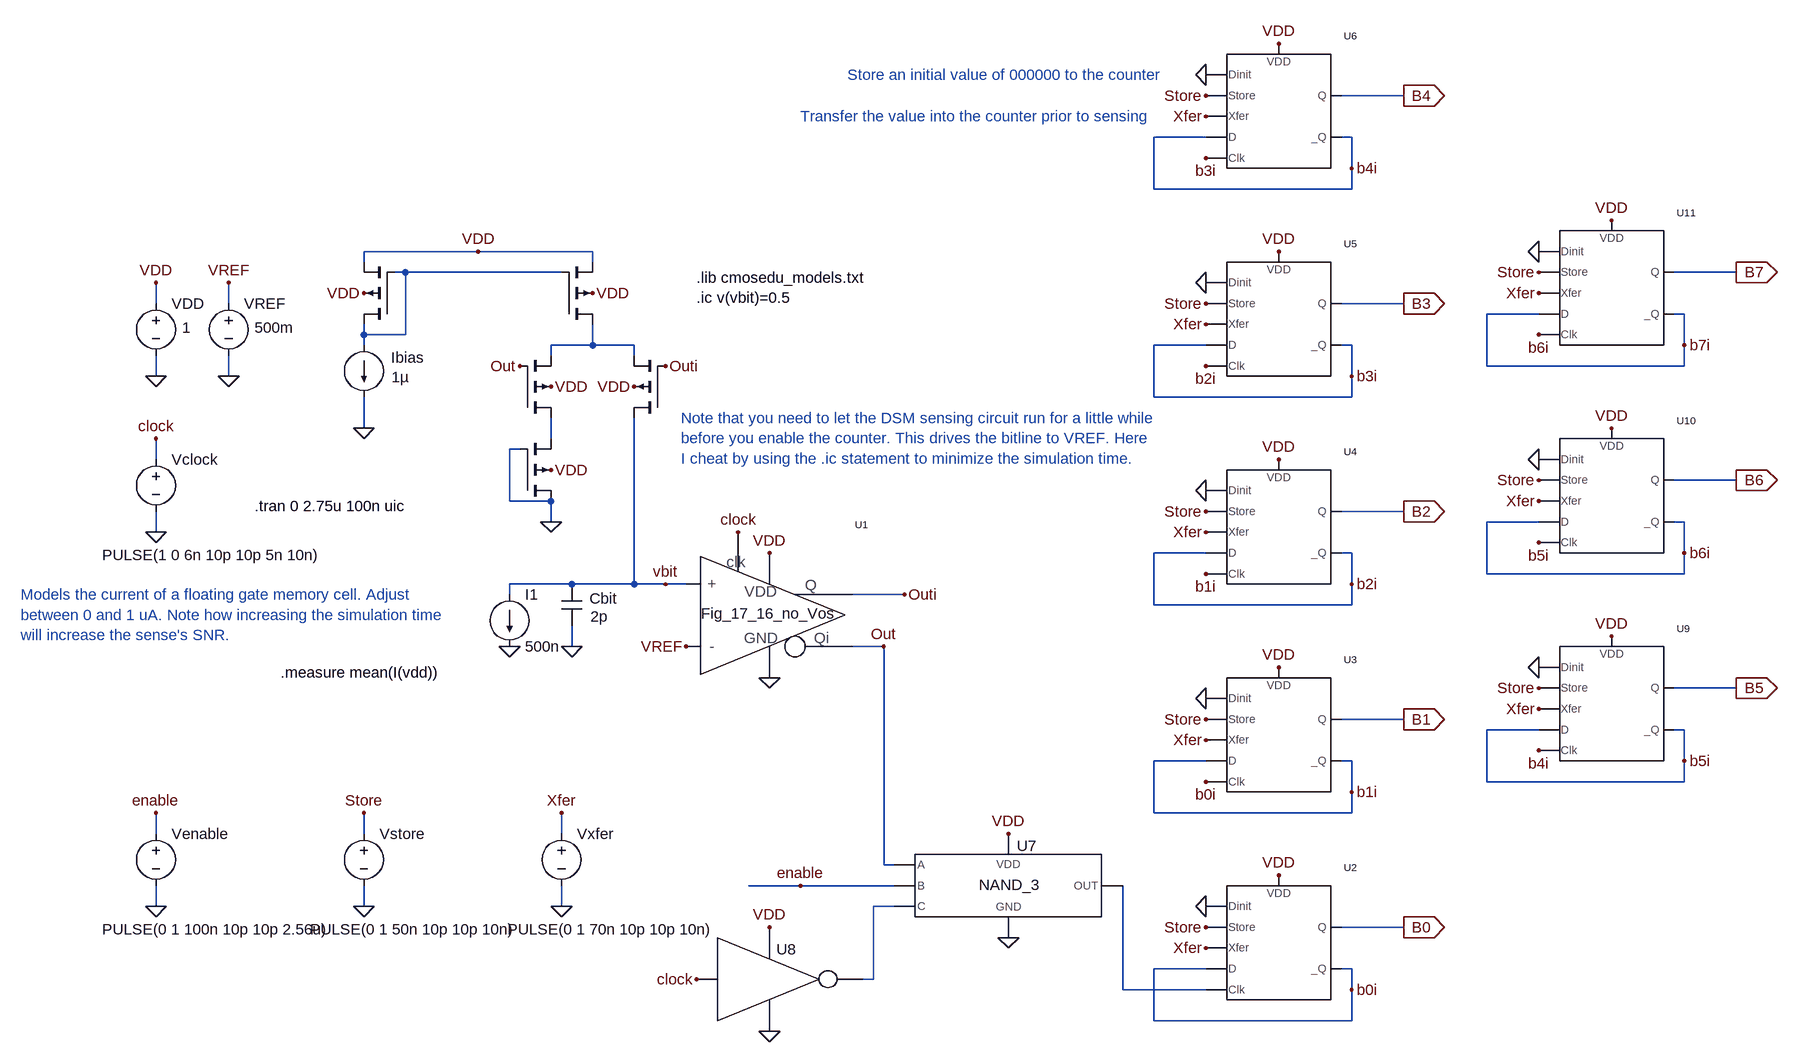
[diagram p0: schematic DSM_sensing_Flash_wcount_8bit.asc]
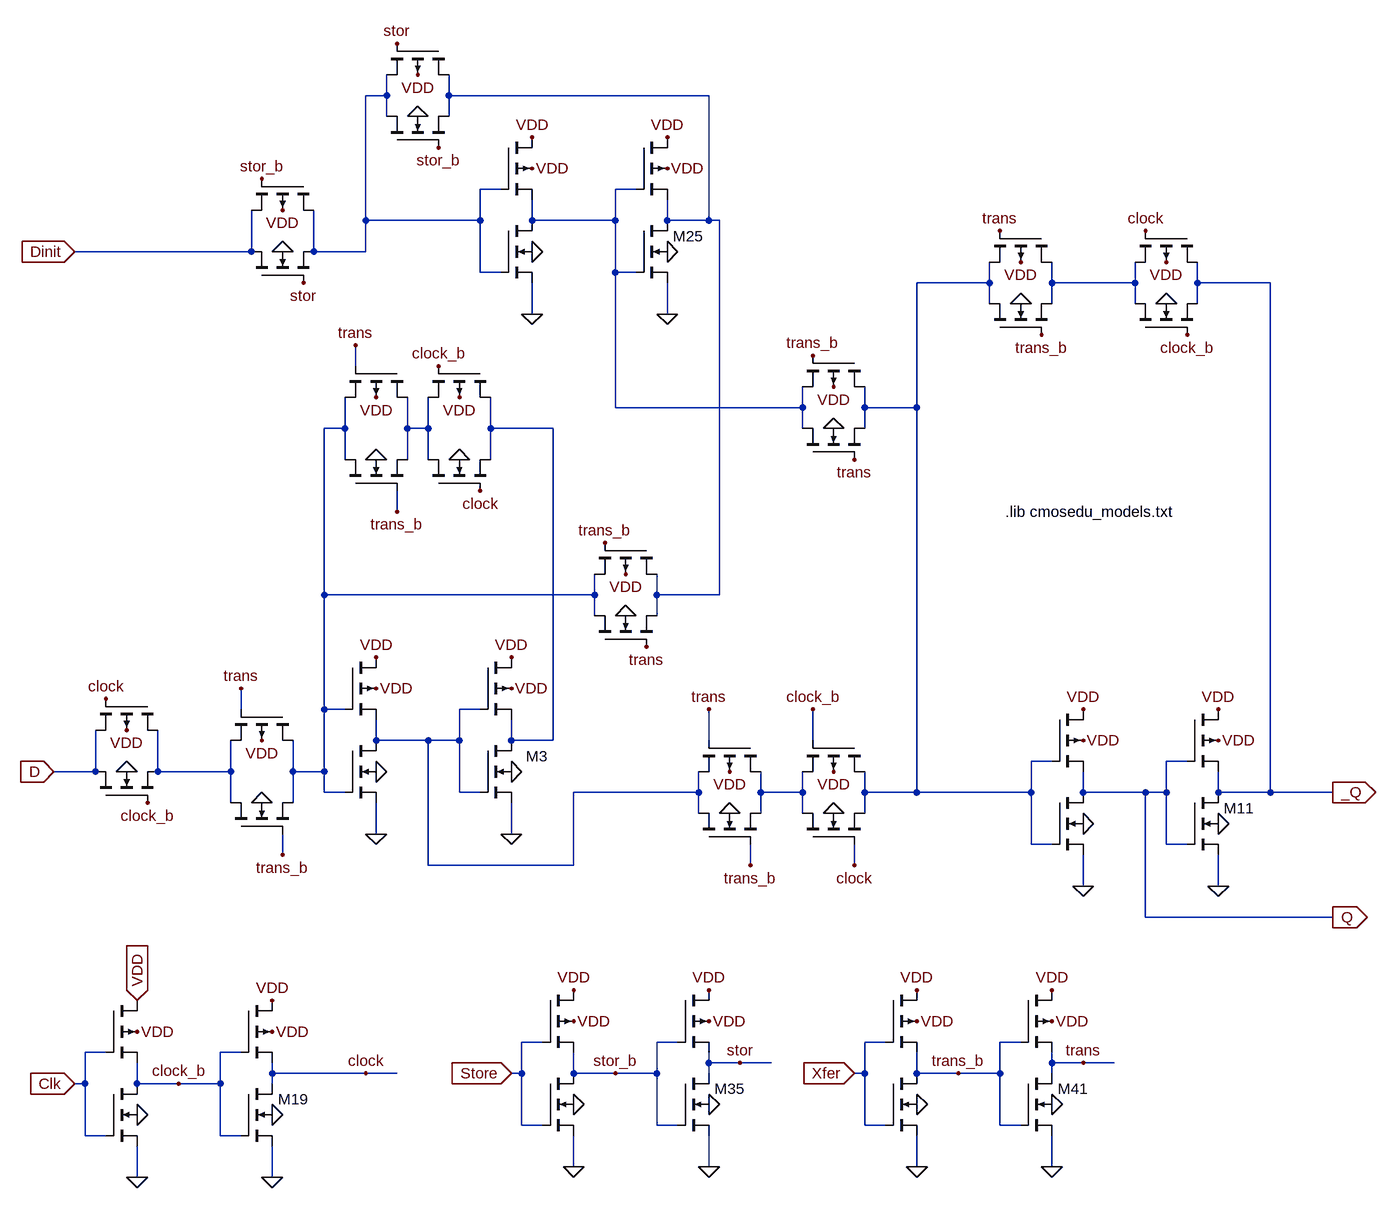
[diagram p1: sub-circuit dsm_counter_bit.asc]
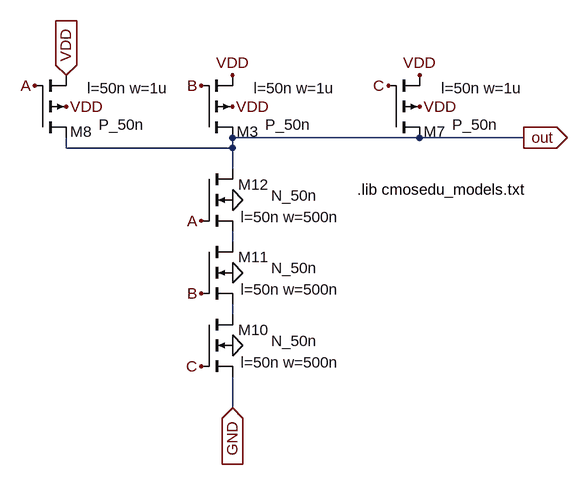
[diagram p2: sub-circuit nand_3.asc]
DSM_sensing_Flash_wcount_8bit.asc, the LTspice schematic file:
Version 4
SHEET 1 2972 1076
WIRE 448 -592 448 -624
WIRE 448 -480 448 -512
WIRE 448 -352 448 -384
WIRE 448 -240 448 -272
WIRE 448 224 448 192
WIRE 448 336 448 304
WIRE 560 -592 560 -624
WIRE 560 -480 560 -512
WIRE 768 -656 768 -672
WIRE 768 -544 768 -560
WIRE 768 -528 768 -544
WIRE 768 -400 768 -448
WIRE 768 224 768 192
WIRE 768 336 768 304
WIRE 832 -640 816 -640
WIRE 832 -544 768 -544
WIRE 832 -544 832 -640
WIRE 944 -672 768 -672
WIRE 992 -288 992 -368
WIRE 992 -144 992 -160
WIRE 1008 -368 992 -368
WIRE 1056 -512 1056 -528
WIRE 1056 -384 1056 -416
WIRE 1056 -288 992 -288
WIRE 1056 -256 1056 -288
WIRE 1072 -640 832 -640
WIRE 1072 224 1072 192
WIRE 1072 336 1072 304
WIRE 1088 -160 992 -160
WIRE 1088 -64 1088 -96
WIRE 1120 -672 944 -672
WIRE 1120 -656 1120 -672
WIRE 1120 -528 1056 -528
WIRE 1120 -528 1120 -560
WIRE 1184 -528 1120 -528
WIRE 1184 -512 1184 -528
WIRE 1184 -160 1088 -160
WIRE 1184 -160 1184 -416
WIRE 1232 -160 1184 -160
WIRE 1264 -160 1232 -160
WIRE 1440 304 1360 304
WIRE 1552 448 1536 448
WIRE 1552 448 1552 336
WIRE 1568 -64 1520 -64
WIRE 1568 272 1568 -64
WIRE 1584 272 1568 272
WIRE 1584 304 1440 304
WIRE 1584 336 1552 336
WIRE 1600 -144 1520 -144
WIRE 1936 464 1936 304
WIRE 1984 -768 1984 -848
WIRE 1984 -448 1984 -528
WIRE 1984 -128 1984 -208
WIRE 1984 192 1984 112
WIRE 1984 512 1984 432
WIRE 2064 -848 1984 -848
WIRE 2064 -528 1984 -528
WIRE 2064 -208 1984 -208
WIRE 2064 112 1984 112
WIRE 2064 432 1984 432
WIRE 2064 464 1936 464
WIRE 2288 -848 2272 -848
WIRE 2288 -800 2288 -848
WIRE 2288 -768 1984 -768
WIRE 2288 -768 2288 -800
WIRE 2288 -528 2272 -528
WIRE 2288 -480 2288 -528
WIRE 2288 -448 1984 -448
WIRE 2288 -448 2288 -480
WIRE 2288 -208 2272 -208
WIRE 2288 -160 2288 -208
WIRE 2288 -128 1984 -128
WIRE 2288 -128 2288 -160
WIRE 2288 112 2272 112
WIRE 2288 160 2288 112
WIRE 2288 192 1984 192
WIRE 2288 192 2288 160
WIRE 2288 432 2272 432
WIRE 2288 464 2288 432
WIRE 2288 512 1984 512
WIRE 2288 512 2288 464
WIRE 2368 -912 2272 -912
WIRE 2368 -592 2272 -592
WIRE 2368 -272 2272 -272
WIRE 2368 48 2272 48
WIRE 2368 368 2272 368
WIRE 2496 -496 2496 -576
WIRE 2496 -176 2496 -256
WIRE 2496 144 2496 64
WIRE 2576 -576 2496 -576
WIRE 2576 -256 2496 -256
WIRE 2576 64 2496 64
WIRE 2800 -576 2784 -576
WIRE 2800 -528 2800 -576
WIRE 2800 -496 2496 -496
WIRE 2800 -496 2800 -528
WIRE 2800 -256 2784 -256
WIRE 2800 -208 2800 -256
WIRE 2800 -176 2496 -176
WIRE 2800 -176 2800 -208
WIRE 2800 64 2784 64
WIRE 2800 112 2800 64
WIRE 2800 144 2496 144
WIRE 2800 144 2800 112
WIRE 2880 -640 2784 -640
WIRE 2880 -320 2784 -320
WIRE 2880 0 2784 0
FLAG 448 -480 0
FLAG 448 -624 VDD
FLAG 1056 -336 VDD
FLAG 1184 -464 VDD
FLAG 1232 -160 vbit
FLAG 560 -480 0
FLAG 560 -624 VREF
FLAG 1392 -208 VDD
FLAG 448 -240 0
FLAG 448 -384 clock
FLAG 1264 -64 VREF
FLAG 1088 -64 0
FLAG 1344 -240 clock
FLAG 1392 -16 0
FLAG 1568 -64 Out
FLAG 992 -64 0
FLAG 1600 -144 Outi
FLAG 1056 -464 VDD
FLAG 1056 -256 0
FLAG 1232 -496 Outi
FLAG 1008 -496 Out
FLAG 1120 -608 VDD
FLAG 768 -608 VDD
FLAG 768 -400 0
FLAG 944 -672 VDD
FLAG 1760 384 0
FLAG 1760 224 VDD
FLAG 448 336 0
FLAG 448 192 enable
FLAG 1440 304 enable
FLAG 2176 288 VDD
FLAG 2368 368 B0
IOPIN 2368 368 Out
FLAG 2064 336 0
FLAG 2064 368 Store
FLAG 2064 400 Xfer
FLAG 2176 -32 VDD
FLAG 2368 48 B1
IOPIN 2368 48 Out
FLAG 2064 16 0
FLAG 2064 48 Store
FLAG 2064 80 Xfer
FLAG 2176 -352 VDD
FLAG 2368 -272 B2
IOPIN 2368 -272 Out
FLAG 2064 -304 0
FLAG 2064 -272 Store
FLAG 2064 -240 Xfer
FLAG 2176 -672 VDD
FLAG 2368 -592 B3
IOPIN 2368 -592 Out
FLAG 2064 -624 0
FLAG 2064 -592 Store
FLAG 2064 -560 Xfer
FLAG 2176 -992 VDD
FLAG 2368 -912 B4
IOPIN 2368 -912 Out
FLAG 2064 -944 0
FLAG 2064 -912 Store
FLAG 2064 -880 Xfer
FLAG 2288 464 b0i
FLAG 2064 144 b0i
FLAG 2288 160 b1i
FLAG 2064 -176 b1i
FLAG 2288 -160 b2i
FLAG 2064 -496 b2i
FLAG 2288 -480 b3i
FLAG 2064 -816 b3i
FLAG 2288 -800 b4i
FLAG 768 336 0
FLAG 768 192 Store
FLAG 1072 336 0
FLAG 1072 192 Xfer
FLAG 1392 368 VDD
FLAG 1392 528 0
FLAG 1280 448 clock
FLAG 2688 -80 VDD
FLAG 2880 0 B5
IOPIN 2880 0 Out
FLAG 2576 -32 0
FLAG 2576 0 Store
FLAG 2576 32 Xfer
FLAG 2688 -400 VDD
FLAG 2880 -320 B6
IOPIN 2880 -320 Out
FLAG 2576 -352 0
FLAG 2576 -320 Store
FLAG 2576 -288 Xfer
FLAG 2688 -720 VDD
FLAG 2880 -640 B7
IOPIN 2880 -640 Out
FLAG 2576 -672 0
FLAG 2576 -640 Store
FLAG 2576 -608 Xfer
FLAG 2576 96 b4i
FLAG 2800 112 b5i
FLAG 2576 -224 b5i
FLAG 2800 -208 b6i
FLAG 2576 -544 b6i
FLAG 2800 -528 b7i
SYMBOL voltage 448 -608 R0
WINDOW 123 0 0 Left 0
WINDOW 39 0 0 Left 0
WINDOW 3 40 53 Left 0
SYMATTR Value 1
SYMATTR InstName VDD
SYMBOL pmos4 1008 -288 M180
WINDOW 0 56 32 Invisible 0
WINDOW 3 56 72 Invisible 0
SYMATTR InstName M3
SYMATTR Value P_50n
SYMATTR Value2 l=1u w=1u
SYMBOL pmos4 1232 -416 R180
WINDOW 0 56 32 Invisible 0
WINDOW 3 56 72 Invisible 0
SYMATTR InstName M1
SYMATTR Value P_50n
SYMATTR Value2 l=50n w=1u
SYMBOL voltage 560 -608 R0
WINDOW 123 0 0 Left 0
WINDOW 39 0 0 Left 0
WINDOW 3 40 53 Left 0
SYMATTR Value 500m
SYMATTR InstName VREF
SYMBOL voltage 448 -368 R0
WINDOW 123 0 0 Left 0
WINDOW 39 0 0 Left 0
WINDOW 3 -83 163 Left 0
SYMATTR Value PULSE(1 0 6n 10p 10p 5n 10n)
SYMATTR InstName Vclock
SYMBOL cap 1072 -160 R0
WINDOW 0 43 22 Left 0
WINDOW 3 45 50 Left 0
SYMATTR InstName Cbit
SYMATTR Value 2p
SYMBOL Fig_17_16_no_Vos 1312 -112 R0
SYMATTR InstName U1
SYMBOL current 992 -144 R0
WINDOW 123 0 0 Left 0
WINDOW 39 0 0 Left 0
SYMATTR InstName I1
SYMATTR Value 500n
SYMBOL pmos4 1008 -416 M180
WINDOW 0 56 32 Invisible 0
WINDOW 3 56 72 Invisible 0
SYMATTR InstName M2
SYMATTR Value P_50n
SYMATTR Value2 l=50n w=1u
SYMBOL current 768 -528 R0
WINDOW 0 42 19 Left 0
WINDOW 3 43 49 Left 0
WINDOW 123 0 0 Left 0
WINDOW 39 0 0 Left 0
SYMATTR InstName Ibias
SYMATTR Value 1µ
SYMBOL pmos4 1072 -560 M180
WINDOW 0 56 32 Invisible 0
WINDOW 3 56 72 Invisible 0
SYMATTR InstName M4
SYMATTR Value P_50n
SYMATTR Value2 l=1u w=1u
SYMBOL pmos4 816 -560 R180
WINDOW 0 56 32 Invisible 0
WINDOW 3 56 72 Invisible 0
SYMATTR InstName M5
SYMATTR Value P_50n
SYMATTR Value2 l=1u w=1u
SYMBOL voltage 448 208 R0
WINDOW 123 0 0 Left 0
WINDOW 39 0 0 Left 0
WINDOW 3 -83 163 Left 0
SYMATTR Value PULSE(0 1 100n 10p 10p 2.56u)
SYMATTR InstName Venable
SYMBOL DSM_counter_bit 2096 480 R0
SYMATTR InstName U2
SYMBOL DSM_counter_bit 2096 160 R0
SYMATTR InstName U3
SYMBOL DSM_counter_bit 2096 -160 R0
SYMATTR InstName U4
SYMBOL DSM_counter_bit 2096 -480 R0
SYMATTR InstName U5
SYMBOL DSM_counter_bit 2096 -800 R0
SYMATTR InstName U6
SYMBOL voltage 768 208 R0
WINDOW 123 0 0 Left 0
WINDOW 39 0 0 Left 0
WINDOW 3 -83 163 Left 0
SYMATTR Value PULSE(0 1 50n 10p 10p 10n)
SYMATTR InstName Vstore
SYMBOL voltage 1072 208 R0
WINDOW 123 0 0 Left 0
WINDOW 39 0 0 Left 0
WINDOW 3 -83 163 Left 0
SYMATTR Value PULSE(0 1 70n 10p 10p 10n)
SYMATTR InstName Vxfer
SYMBOL NAND_3 1536 320 R0
SYMATTR InstName U7
SYMBOL INV_20_10 1312 384 R0
SYMATTR InstName U8
SYMBOL DSM_counter_bit 2608 112 R0
SYMATTR InstName U9
SYMBOL DSM_counter_bit 2608 -208 R0
SYMATTR InstName U10
SYMBOL DSM_counter_bit 2608 -528 R0
SYMATTR InstName U11
TEXT 1280 -632 Left 0 !.lib cmosedu_models.txt\n.ic v(vbit)=0.5
TEXT 600 -280 Left 0 !.tran 0 2.75u 100n uic
TEXT 240 -144 Left 0 ;Models the current of a floating gate memory cell. Adjust\nbetween 0 and 1 uA. Note how increasing the simulation time\nwill increase the sense's SNR.
TEXT 640 -24 Left 0 !.measure mean(I(vdd))
TEXT 1256 -416 Left 0 ;Note that you need to let the DSM sensing circuit run for a little while \nbefore you enable the counter. This drives the bitline to VREF. Here\nI cheat by using the .ic statement to minimize the simulation time.
TEXT 1512 -944 Left 0 ;Store an initial value of 000000 to the counter
TEXT 1440 -880 Left 0 ;Transfer the value into the counter prior to sensing

dsm_counter_bit.asc, the sub-circuit schematic file:
Version 4
SHEET 1 6296 900
WIRE 304 720 288 720
WIRE 304 720 304 672
WIRE 304 800 304 720
WIRE 320 240 256 240
WIRE 320 240 320 176
WIRE 336 672 304 672
WIRE 336 800 304 800
WIRE 384 720 384 688
WIRE 384 864 384 816
WIRE 416 240 416 176
WIRE 448 720 384 720
WIRE 512 720 448 720
WIRE 512 720 512 672
WIRE 512 800 512 720
WIRE 528 240 416 240
WIRE 528 240 528 192
WIRE 528 288 528 240
WIRE 544 144 544 112
WIRE 544 672 512 672
WIRE 544 800 512 800
WIRE 560 -560 288 -560
WIRE 560 -560 560 -624
WIRE 592 704 592 688
WIRE 592 720 592 704
WIRE 592 864 592 816
WIRE 608 368 608 336
WIRE 624 240 624 192
WIRE 624 288 624 240
WIRE 656 -560 656 -624
WIRE 672 -32 672 -288
WIRE 672 144 672 -32
WIRE 672 240 624 240
WIRE 672 240 672 144
WIRE 672 272 672 240
WIRE 704 -288 672 -288
WIRE 704 -288 704 -336
WIRE 704 -240 704 -288
WIRE 704 144 672 144
WIRE 704 272 672 272
WIRE 720 -384 720 -416
WIRE 736 -608 736 -800
WIRE 736 -560 656 -560
WIRE 736 -560 736 -608
WIRE 736 704 592 704
WIRE 752 192 752 160
WIRE 752 336 752 288
WIRE 768 -800 736 -800
WIRE 768 -800 768 -832
WIRE 768 -768 768 -800
WIRE 784 -160 784 -192
WIRE 784 704 736 704
WIRE 800 -288 800 -336
WIRE 800 -240 800 -288
WIRE 832 -288 800 -288
WIRE 832 -288 832 -336
WIRE 832 -240 832 -288
WIRE 832 192 752 192
WIRE 832 384 832 192
WIRE 864 -800 864 -832
WIRE 864 -768 864 -800
WIRE 880 192 832 192
WIRE 880 192 880 144
WIRE 880 272 880 192
WIRE 912 -608 736 -608
WIRE 912 -608 912 -656
WIRE 912 -528 912 -608
WIRE 912 144 880 144
WIRE 912 272 880 272
WIRE 928 -288 928 -336
WIRE 928 -240 928 -288
WIRE 944 -656 912 -656
WIRE 944 -528 912 -528
WIRE 960 192 960 160
WIRE 960 336 960 288
WIRE 976 704 960 704
WIRE 976 704 976 656
WIRE 976 784 976 704
WIRE 992 -608 992 -640
WIRE 992 -464 992 -512
WIRE 1008 656 976 656
WIRE 1008 784 976 784
WIRE 1024 -288 928 -288
WIRE 1024 192 960 192
WIRE 1024 192 1024 -288
WIRE 1056 384 832 384
WIRE 1056 384 1056 272
WIRE 1056 704 1056 672
WIRE 1056 848 1056 800
WIRE 1088 -32 672 -32
WIRE 1088 -32 1088 -64
WIRE 1088 0 1088 -32
WIRE 1120 -608 992 -608
WIRE 1120 -608 1120 -656
WIRE 1120 -528 1120 -608
WIRE 1120 -320 1120 -528
WIRE 1120 704 1056 704
WIRE 1152 -656 1120 -656
WIRE 1152 -528 1120 -528
WIRE 1184 -32 1184 -64
WIRE 1184 0 1184 -32
WIRE 1184 704 1120 704
WIRE 1184 704 1184 656
WIRE 1184 784 1184 704
WIRE 1200 -608 1200 -640
WIRE 1200 -464 1200 -512
WIRE 1216 656 1184 656
WIRE 1216 784 1184 784
WIRE 1248 272 1056 272
WIRE 1248 272 1248 240
WIRE 1248 304 1248 272
WIRE 1264 -800 864 -800
WIRE 1264 -608 1200 -608
WIRE 1264 -608 1264 -800
WIRE 1264 192 1264 144
WIRE 1264 688 1264 672
WIRE 1264 704 1264 688
WIRE 1264 848 1264 800
WIRE 1280 -608 1264 -608
WIRE 1280 -32 1184 -32
WIRE 1280 -32 1280 -608
WIRE 1312 688 1264 688
WIRE 1328 384 1328 352
WIRE 1344 272 1344 240
WIRE 1344 304 1344 272
WIRE 1360 688 1312 688
WIRE 1408 -320 1120 -320
WIRE 1408 -320 1408 -352
WIRE 1408 -288 1408 -320
WIRE 1408 272 1344 272
WIRE 1408 272 1408 240
WIRE 1408 304 1408 272
WIRE 1424 192 1424 144
WIRE 1488 384 1488 352
WIRE 1504 -320 1504 -352
WIRE 1504 -288 1504 -320
WIRE 1504 272 1504 240
WIRE 1504 304 1504 272
WIRE 1504 704 1488 704
WIRE 1504 704 1504 656
WIRE 1504 784 1504 704
WIRE 1536 656 1504 656
WIRE 1536 784 1504 784
WIRE 1584 -320 1504 -320
WIRE 1584 -320 1584 -512
WIRE 1584 272 1504 272
WIRE 1584 272 1584 -320
WIRE 1584 704 1584 672
WIRE 1584 848 1584 800
WIRE 1648 704 1584 704
WIRE 1696 -512 1584 -512
WIRE 1696 -512 1696 -544
WIRE 1696 -480 1696 -512
WIRE 1712 704 1648 704
WIRE 1712 704 1712 656
WIRE 1712 784 1712 704
WIRE 1744 656 1712 656
WIRE 1744 784 1712 784
WIRE 1760 272 1584 272
WIRE 1760 272 1760 224
WIRE 1760 352 1760 272
WIRE 1792 -512 1792 -544
WIRE 1792 -480 1792 -512
WIRE 1792 224 1760 224
WIRE 1792 352 1760 352
WIRE 1792 688 1792 672
WIRE 1792 704 1792 688
WIRE 1792 848 1792 800
WIRE 1840 272 1840 240
WIRE 1840 416 1840 368
WIRE 1840 688 1792 688
WIRE 1888 688 1840 688
WIRE 1920 -512 1792 -512
WIRE 1920 -512 1920 -544
WIRE 1920 -480 1920 -512
WIRE 1936 272 1840 272
WIRE 1936 464 1936 272
WIRE 1968 272 1936 272
WIRE 1968 272 1968 224
WIRE 1968 352 1968 272
WIRE 2000 224 1968 224
WIRE 2000 352 1968 352
WIRE 2016 -512 2016 -544
WIRE 2016 -480 2016 -512
WIRE 2048 272 2048 240
WIRE 2048 416 2048 368
WIRE 2128 -512 2016 -512
WIRE 2128 272 2048 272
WIRE 2128 272 2128 -512
WIRE 2224 272 2128 272
WIRE 2224 464 1936 464
FLAG 752 240 0
FLAG 752 112 VDD
FLAG 752 336 0
FLAG 752 64 VDD
FLAG 960 240 0
FLAG 960 112 VDD
FLAG 960 336 0
FLAG 960 64 VDD
FLAG 368 240 0
FLAG 400 288 clock_b
FLAG 368 176 VDD
FLAG 336 128 clock
FLAG 880 -240 0
FLAG 912 -192 clock
FLAG 880 -336 VDD
FLAG 848 -384 clock_b
FLAG 1840 320 0
FLAG 1840 192 VDD
FLAG 1840 416 0
FLAG 1840 144 VDD
FLAG 2048 320 0
FLAG 2048 192 VDD
FLAG 2048 416 0
FLAG 2048 144 VDD
FLAG 1456 304 0
FLAG 1488 384 clock
FLAG 2224 272 _Q
IOPIN 2224 272 Out
FLAG 2224 464 Q
IOPIN 2224 464 Out
FLAG 1456 240 VDD
FLAG 1424 144 clock_b
FLAG 1968 -480 0
FLAG 2000 -432 clock_b
FLAG 1968 -544 VDD
FLAG 1936 -592 clock
FLAG 256 240 D
IOPIN 256 240 In
FLAG 384 768 0
FLAG 384 640 VDD
FLAG 384 864 0
FLAG 384 592 VDD
IOPIN 384 592 In
FLAG 592 768 0
FLAG 592 640 VDD
FLAG 592 864 0
FLAG 592 592 VDD
FLAG 736 704 clock
FLAG 448 720 clock_b
FLAG 288 720 Clk
IOPIN 288 720 In
FLAG 1296 304 0
FLAG 1328 384 trans_b
FLAG 1296 240 VDD
FLAG 1264 144 trans
FLAG 992 -560 0
FLAG 992 -688 VDD
FLAG 992 -464 0
FLAG 992 -736 VDD
FLAG 1200 -560 0
FLAG 1200 -688 VDD
FLAG 1200 -464 0
FLAG 1200 -736 VDD
FLAG 608 -560 0
FLAG 640 -512 stor
FLAG 608 -624 VDD
FLAG 576 -672 stor_b
FLAG 816 -768 0
FLAG 848 -720 stor_b
FLAG 816 -832 VDD
FLAG 784 -880 stor
FLAG 288 -560 Dinit
IOPIN 288 -560 In
FLAG 1456 -288 0
FLAG 1488 -240 trans
FLAG 1456 -352 VDD
FLAG 1424 -400 trans_b
FLAG 1056 752 0
FLAG 1056 624 VDD
FLAG 1056 848 0
FLAG 1056 576 VDD
FLAG 1264 752 0
FLAG 1264 624 VDD
FLAG 1264 848 0
FLAG 1264 576 VDD
FLAG 1312 688 stor
FLAG 1120 704 stor_b
FLAG 960 704 Store
IOPIN 960 704 In
FLAG 1744 -480 0
FLAG 1776 -432 trans_b
FLAG 1744 -544 VDD
FLAG 1712 -592 trans
FLAG 1584 752 0
FLAG 1584 624 VDD
FLAG 1584 848 0
FLAG 1584 576 VDD
FLAG 1792 752 0
FLAG 1792 624 VDD
FLAG 1792 848 0
FLAG 1792 576 VDD
FLAG 1840 688 trans
FLAG 1648 704 trans_b
FLAG 1488 704 Xfer
IOPIN 1488 704 In
FLAG 752 -240 0
FLAG 784 -160 trans_b
FLAG 752 -336 VDD
FLAG 720 -416 trans
FLAG 576 288 0
FLAG 608 368 trans_b
FLAG 576 192 VDD
FLAG 544 112 trans
FLAG 1136 0 0
FLAG 1168 48 trans
FLAG 1136 -64 VDD
FLAG 1104 -112 trans_b
SYMBOL nmos4 704 192 R0
WINDOW 0 104 24 Invisible 0
WINDOW 3 179 41 Invisible 0
SYMATTR InstName M1
SYMATTR Value N_50n
SYMATTR Value2 l=50n w=500n
SYMBOL pmos4 704 64 R0
WINDOW 0 88 9 Invisible 0
WINDOW 3 168 20 Invisible 0
SYMATTR InstName M2
SYMATTR Value P_50n
SYMATTR Value2 l=50n w=1u
SYMBOL nmos4 912 192 R0
WINDOW 0 104 24 Right 0
WINDOW 3 179 41 Invisible 0
SYMATTR InstName M3
SYMATTR Value N_50n
SYMATTR Value2 l=50n w=500n
SYMBOL pmos4 912 64 R0
WINDOW 0 88 9 Invisible 0
WINDOW 3 168 20 Invisible 0
SYMATTR InstName M4
SYMATTR Value P_50n
SYMATTR Value2 l=50n w=1u
SYMBOL nmos4 320 288 R270
WINDOW 0 86 42 Invisible 0
WINDOW 3 82 140 Invisible 0
SYMATTR InstName M5
SYMATTR Value N_50n
SYMATTR Value2 l=50n w=500n
SYMBOL pmos4 416 128 R90
WINDOW 0 71 26 Invisible 0
WINDOW 3 75 133 Invisible 0
SYMATTR InstName M6
SYMATTR Value P_50n
SYMATTR Value2 l=50n w=1u
SYMBOL nmos4 832 -192 R270
WINDOW 0 86 42 Invisible 0
WINDOW 3 82 140 Invisible 0
SYMATTR InstName M7
SYMATTR Value N_50n
SYMATTR Value2 l=50n w=500n
SYMBOL pmos4 928 -384 R90
WINDOW 0 71 26 Invisible 0
WINDOW 3 75 133 Invisible 0
SYMATTR InstName M8
SYMATTR Value P_50n
SYMATTR Value2 l=50n w=1u
SYMBOL nmos4 1792 272 R0
WINDOW 0 104 24 Invisible 0
WINDOW 3 179 41 Invisible 0
SYMATTR InstName M9
SYMATTR Value N_50n
SYMATTR Value2 l=50n w=500n
SYMBOL pmos4 1792 144 R0
WINDOW 0 88 9 Invisible 0
WINDOW 3 168 20 Invisible 0
SYMATTR InstName M10
SYMATTR Value P_50n
SYMATTR Value2 l=50n w=1u
SYMBOL nmos4 2000 272 R0
WINDOW 0 104 24 Right 0
WINDOW 3 179 41 Invisible 0
SYMATTR InstName M11
SYMATTR Value N_50n
SYMATTR Value2 l=50n w=500n
SYMBOL pmos4 2000 144 R0
WINDOW 0 88 9 Invisible 0
WINDOW 3 168 20 Invisible 0
SYMATTR InstName M12
SYMATTR Value P_50n
SYMATTR Value2 l=50n w=1u
SYMBOL nmos4 1408 352 R270
WINDOW 0 86 42 Invisible 0
WINDOW 3 82 140 Invisible 0
SYMATTR InstName M13
SYMATTR Value N_50n
SYMATTR Value2 l=50n w=500n
SYMBOL pmos4 1504 192 R90
WINDOW 0 71 26 Invisible 0
WINDOW 3 75 133 Invisible 0
SYMATTR InstName M14
SYMATTR Value P_50n
SYMATTR Value2 l=50n w=1u
SYMBOL nmos4 1920 -432 R270
WINDOW 0 86 42 Invisible 0
WINDOW 3 82 140 Invisible 0
SYMATTR InstName M15
SYMATTR Value N_50n
SYMATTR Value2 l=50n w=500n
SYMBOL pmos4 2016 -592 R90
WINDOW 0 71 26 Invisible 0
WINDOW 3 75 133 Invisible 0
SYMATTR InstName M16
SYMATTR Value P_50n
SYMATTR Value2 l=50n w=1u
SYMBOL nmos4 336 720 R0
WINDOW 0 104 24 Invisible 0
WINDOW 3 179 41 Invisible 0
SYMATTR InstName M17
SYMATTR Value N_50n
SYMATTR Value2 l=50n w=500n
SYMBOL pmos4 336 592 R0
WINDOW 0 88 9 Invisible 0
WINDOW 3 168 20 Invisible 0
SYMATTR InstName M18
SYMATTR Value P_50n
SYMATTR Value2 l=50n w=1u
SYMBOL nmos4 544 720 R0
WINDOW 0 104 24 Right 0
WINDOW 3 179 41 Invisible 0
SYMATTR InstName M19
SYMATTR Value N_50n
SYMATTR Value2 l=50n w=500n
SYMBOL pmos4 544 592 R0
WINDOW 0 88 9 Invisible 0
WINDOW 3 168 20 Invisible 0
SYMATTR InstName M20
SYMATTR Value P_50n
SYMATTR Value2 l=50n w=1u
SYMBOL nmos4 1248 352 R270
WINDOW 0 86 42 Invisible 0
WINDOW 3 82 140 Invisible 0
SYMATTR InstName M21
SYMATTR Value N_50n
SYMATTR Value2 l=50n w=500n
SYMBOL pmos4 1344 192 R90
WINDOW 0 71 26 Invisible 0
WINDOW 3 75 133 Invisible 0
SYMATTR InstName M22
SYMATTR Value P_50n
SYMATTR Value2 l=50n w=1u
SYMBOL nmos4 944 -608 R0
WINDOW 0 104 24 Invisible 0
WINDOW 3 179 41 Invisible 0
SYMATTR InstName M23
SYMATTR Value N_50n
SYMATTR Value2 l=50n w=500n
SYMBOL pmos4 944 -736 R0
WINDOW 0 88 9 Invisible 0
WINDOW 3 168 20 Invisible 0
SYMATTR InstName M24
SYMATTR Value P_50n
SYMATTR Value2 l=50n w=1u
SYMBOL nmos4 1152 -608 R0
WINDOW 0 104 24 Right 0
WINDOW 3 179 41 Invisible 0
SYMATTR InstName M25
SYMATTR Value N_50n
SYMATTR Value2 l=50n w=500n
SYMBOL pmos4 1152 -736 R0
WINDOW 0 88 9 Invisible 0
WINDOW 3 168 20 Invisible 0
SYMATTR InstName M26
SYMATTR Value P_50n
SYMATTR Value2 l=50n w=1u
SYMBOL nmos4 560 -512 R270
WINDOW 0 86 42 Invisible 0
WINDOW 3 82 140 Invisible 0
SYMATTR InstName M27
SYMATTR Value N_50n
SYMATTR Value2 l=50n w=500n
SYMBOL pmos4 656 -672 R90
WINDOW 0 71 26 Invisible 0
WINDOW 3 75 133 Invisible 0
SYMATTR InstName M28
SYMATTR Value P_50n
SYMATTR Value2 l=50n w=1u
SYMBOL nmos4 768 -720 R270
WINDOW 0 86 42 Invisible 0
WINDOW 3 82 140 Invisible 0
SYMATTR InstName M29
SYMATTR Value N_50n
SYMATTR Value2 l=50n w=500n
SYMBOL pmos4 864 -880 R90
WINDOW 0 71 26 Invisible 0
WINDOW 3 75 133 Invisible 0
SYMATTR InstName M30
SYMATTR Value P_50n
SYMATTR Value2 l=50n w=1u
SYMBOL nmos4 1408 -240 R270
WINDOW 0 86 42 Invisible 0
WINDOW 3 82 140 Invisible 0
SYMATTR InstName M31
SYMATTR Value N_50n
SYMATTR Value2 l=50n w=500n
SYMBOL pmos4 1504 -400 R90
WINDOW 0 71 26 Invisible 0
WINDOW 3 75 133 Invisible 0
SYMATTR InstName M32
SYMATTR Value P_50n
SYMATTR Value2 l=50n w=1u
SYMBOL nmos4 1008 704 R0
WINDOW 0 104 24 Invisible 0
WINDOW 3 179 41 Invisible 0
SYMATTR InstName M33
SYMATTR Value N_50n
SYMATTR Value2 l=50n w=500n
SYMBOL pmos4 1008 576 R0
WINDOW 0 88 9 Invisible 0
WINDOW 3 168 20 Invisible 0
SYMATTR InstName M34
SYMATTR Value P_50n
SYMATTR Value2 l=50n w=1u
SYMBOL nmos4 1216 704 R0
WINDOW 0 104 24 Right 0
WINDOW 3 179 41 Invisible 0
SYMATTR InstName M35
SYMATTR Value N_50n
SYMATTR Value2 l=50n w=500n
SYMBOL pmos4 1216 576 R0
WINDOW 0 88 9 Invisible 0
WINDOW 3 168 20 Invisible 0
SYMATTR InstName M36
SYMATTR Value P_50n
SYMATTR Value2 l=50n w=1u
SYMBOL nmos4 1696 -432 R270
WINDOW 0 86 42 Invisible 0
WINDOW 3 82 140 Invisible 0
SYMATTR InstName M37
SYMATTR Value N_50n
SYMATTR Value2 l=50n w=500n
SYMBOL pmos4 1792 -592 R90
WINDOW 0 71 26 Invisible 0
WINDOW 3 75 133 Invisible 0
SYMATTR InstName M38
SYMATTR Value P_50n
SYMATTR Value2 l=50n w=1u
SYMBOL nmos4 1536 704 R0
WINDOW 0 104 24 Invisible 0
WINDOW 3 179 41 Invisible 0
SYMATTR InstName M39
SYMATTR Value N_50n
SYMATTR Value2 l=50n w=500n
SYMBOL pmos4 1536 576 R0
WINDOW 0 88 9 Invisible 0
WINDOW 3 168 20 Invisible 0
SYMATTR InstName M40
SYMATTR Value P_50n
SYMATTR Value2 l=50n w=1u
SYMBOL nmos4 1744 704 R0
WINDOW 0 104 24 Right 0
WINDOW 3 179 41 Invisible 0
SYMATTR InstName M41
SYMATTR Value N_50n
SYMATTR Value2 l=50n w=500n
SYMBOL pmos4 1744 576 R0
WINDOW 0 88 9 Invisible 0
WINDOW 3 168 20 Invisible 0
SYMATTR InstName M42
SYMATTR Value P_50n
SYMATTR Value2 l=50n w=1u
SYMBOL nmos4 704 -192 R270
WINDOW 0 86 42 Invisible 0
WINDOW 3 82 140 Invisible 0
SYMATTR InstName M43
SYMATTR Value N_50n
SYMATTR Value2 l=50n w=500n
SYMBOL pmos4 800 -384 R90
WINDOW 0 71 26 Invisible 0
WINDOW 3 75 133 Invisible 0
SYMATTR InstName M44
SYMATTR Value P_50n
SYMATTR Value2 l=50n w=1u
SYMBOL nmos4 528 336 R270
WINDOW 0 86 42 Invisible 0
WINDOW 3 82 140 Invisible 0
SYMATTR InstName M45
SYMATTR Value N_50n
SYMATTR Value2 l=50n w=500n
SYMBOL pmos4 624 144 R90
WINDOW 0 71 26 Invisible 0
WINDOW 3 75 133 Invisible 0
SYMATTR InstName M46
SYMATTR Value P_50n
SYMATTR Value2 l=50n w=1u
SYMBOL nmos4 1088 48 R270
WINDOW 0 86 42 Invisible 0
WINDOW 3 82 140 Invisible 0
SYMATTR InstName M47
SYMATTR Value N_50n
SYMATTR Value2 l=50n w=500n
SYMBOL pmos4 1184 -112 R90
WINDOW 0 71 26 Invisible 0
WINDOW 3 75 133 Invisible 0
SYMATTR InstName M48
SYMATTR Value P_50n
SYMATTR Value2 l=50n w=1u
TEXT 1720 -160 Left 0 !.lib cmosedu_models.txt

nand_3.asc, the sub-circuit schematic file:
Version 4
SHEET 1 6288 680
WIRE 912 -400 912 -416
WIRE 1168 -400 912 -400
WIRE 1168 -400 1168 -416
WIRE 1168 -368 1168 -400
WIRE 1168 -256 1168 -272
WIRE 1168 -144 1168 -160
WIRE 1168 0 1168 -48
WIRE 1456 -416 1168 -416
WIRE 1616 -416 1456 -416
FLAG 1168 -464 VDD
FLAG 1456 -464 VDD
FLAG 912 -464 VDD
FLAG 1168 -96 0
FLAG 1168 -208 0
FLAG 1168 -320 0
FLAG 1168 -512 VDD
FLAG 1456 -512 VDD
FLAG 912 -512 VDD
IOPIN 912 -512 In
FLAG 1168 0 GND
IOPIN 1168 0 In
FLAG 1616 -416 out
IOPIN 1616 -416 Out
FLAG 864 -496 A
FLAG 1120 -288 A
FLAG 1120 -496 B
FLAG 1120 -176 B
FLAG 1408 -496 C
FLAG 1120 -64 C
SYMBOL pmos4 1120 -416 M180
WINDOW 0 88 9 Right 0
WINDOW 3 168 20 Right 0
WINDOW 123 206 76 Right 0
SYMATTR InstName M3
SYMATTR Value P_50n
SYMATTR Value2 l=50n w=1u
SYMBOL pmos4 1408 -416 M180
WINDOW 0 88 9 Right 0
WINDOW 3 168 20 Right 0
WINDOW 123 206 76 Right 0
SYMATTR InstName M7
SYMATTR Value P_50n
SYMATTR Value2 l=50n w=1u
SYMBOL pmos4 864 -416 M180
WINDOW 0 88 9 Right 0
WINDOW 3 168 20 Right 0
WINDOW 123 206 76 Right 0
SYMATTR InstName M8
SYMATTR Value P_50n
SYMATTR Value2 l=50n w=1u
SYMBOL nmos4 1120 -144 R0
WINDOW 0 104 24 Right 0
WINDOW 3 179 41 Right 0
WINDOW 123 213 74 Right 0
SYMATTR InstName M10
SYMATTR Value N_50n
SYMATTR Value2 l=50n w=500n
SYMBOL nmos4 1120 -256 R0
WINDOW 0 104 24 Right 0
WINDOW 3 179 41 Right 0
WINDOW 123 213 74 Right 0
SYMATTR InstName M11
SYMATTR Value N_50n
SYMATTR Value2 l=50n w=500n
SYMBOL nmos4 1120 -368 R0
WINDOW 0 104 24 Right 0
WINDOW 3 179 41 Right 0
WINDOW 123 213 74 Right 0
SYMATTR InstName M12
SYMATTR Value N_50n
SYMATTR Value2 l=50n w=500n
TEXT 1360 -336 Left 0 !.lib cmosedu_models.txt

The netlist it stands for:
* DSM_sensing_Flash_wcount_8bit.asc
VDD VDD 0 1
M3 0 0 N003 VDD P_50n l=1u w=1u
M1 vbit Outi N002 VDD P_50n l=50n w=1u
VREF VREF 0 500m
Vclock clock 0 PULSE(1 0 6n 10p 10p 5n 10n)
Cbit vbit 0 2p
XU1 vbit VREF Outi Out clock VDD 0 Fig_17_16_no_Vos params: Fig_17_16_no_Vos  ; pins inp inm q qi clock VDD GND
I1 vbit 0 500n
M2 N003 Out N002 VDD P_50n l=50n w=1u
Ibias N001 0 1µ
M4 N002 N001 VDD VDD P_50n l=1u w=1u
M5 N001 N001 VDD VDD P_50n l=1u w=1u
Venable enable 0 PULSE(0 1 100n 10p 10p 2.56u)
XU2 0 b0i N005 Store Xfer B0 b0i VDD dsm_counter_bit
XU3 0 b1i b0i Store Xfer B1 b1i VDD dsm_counter_bit
XU4 0 b2i b1i Store Xfer B2 b2i VDD dsm_counter_bit
XU5 0 b3i b2i Store Xfer B3 b3i VDD dsm_counter_bit
XU6 0 b4i b3i Store Xfer B4 b4i VDD dsm_counter_bit
Vstore Store 0 PULSE(0 1 50n 10p 10p 10n)
Vxfer Xfer 0 PULSE(0 1 70n 10p 10p 10n)
XU7 Out enable N004 N005 VDD 0 nand_3 params: NAND_3
XU8 clock N004 VDD 0 INV_20_10  ; pins In Out VDD GND
XU9 0 b5i b4i Store Xfer B5 b5i VDD dsm_counter_bit
XU10 0 b6i b5i Store Xfer B6 b6i VDD dsm_counter_bit
XU11 0 b7i b6i Store Xfer B7 b7i VDD dsm_counter_bit

* block symbol definitions
.subckt dsm_counter_bit Dinit D Clk Store Xfer Q _Q VDD
M1 N004 N002 0 0 N_50n l=50n w=500n
M2 VDD N002 N004 VDD P_50n l=50n w=1u
M3 N007 N004 0 0 N_50n l=50n w=500n
M4 VDD N004 N007 VDD P_50n l=50n w=1u
M5 D clock_b N001 0 N_50n l=50n w=500n
M6 N001 clock D VDD P_50n l=50n w=1u
M7 N005 clock N007 0 N_50n l=50n w=500n
M8 N007 clock_b N005 VDD P_50n l=50n w=1u
M9 Q N010 0 0 N_50n l=50n w=500n
M10 VDD N010 Q VDD P_50n l=50n w=1u
M11 _Q Q 0 0 N_50n l=50n w=500n
M12 VDD Q _Q VDD P_50n l=50n w=1u
M13 N009 clock N010 0 N_50n l=50n w=500n
M14 N010 clock_b N009 VDD P_50n l=50n w=1u
M15 N011 clock_b _Q 0 N_50n l=50n w=500n
M16 _Q clock N011 VDD P_50n l=50n w=1u
M17 clock_b Clk 0 0 N_50n l=50n w=500n
M18 VDD Clk clock_b VDD P_50n l=50n w=1u
M19 clock clock_b 0 0 N_50n l=50n w=500n
M20 VDD clock_b clock VDD P_50n l=50n w=1u
M21 N004 trans_b N009 0 N_50n l=50n w=500n
M22 N009 trans N004 VDD P_50n l=50n w=1u
M23 N008 N003 0 0 N_50n l=50n w=500n
M24 VDD N003 N008 VDD P_50n l=50n w=1u
M25 N006 N008 0 0 N_50n l=50n w=500n
M26 VDD N008 N006 VDD P_50n l=50n w=1u
M27 Dinit stor N003 0 N_50n l=50n w=500n
M28 N003 stor_b Dinit VDD P_50n l=50n w=1u
M29 N003 stor_b N006 0 N_50n l=50n w=500n
M30 N006 stor N003 VDD P_50n l=50n w=1u
M31 N008 trans N010 0 N_50n l=50n w=500n
M32 N010 trans_b N008 VDD P_50n l=50n w=1u
M33 stor_b Store 0 0 N_50n l=50n w=500n
M34 VDD Store stor_b VDD P_50n l=50n w=1u
M35 stor stor_b 0 0 N_50n l=50n w=500n
M36 VDD stor_b stor VDD P_50n l=50n w=1u
M37 N010 trans_b N011 0 N_50n l=50n w=500n
M38 N011 trans N010 VDD P_50n l=50n w=1u
M39 trans_b Xfer 0 0 N_50n l=50n w=500n
M40 VDD Xfer trans_b VDD P_50n l=50n w=1u
M41 trans trans_b 0 0 N_50n l=50n w=500n
M42 VDD trans_b trans VDD P_50n l=50n w=1u
M43 N002 trans_b N005 0 N_50n l=50n w=500n
M44 N005 trans N002 VDD P_50n l=50n w=1u
M45 N001 trans_b N002 0 N_50n l=50n w=500n
M46 N002 trans N001 VDD P_50n l=50n w=1u
M47 N002 trans N006 0 N_50n l=50n w=500n
M48 N006 trans_b N002 VDD P_50n l=50n w=1u
.lib cmosedu_models.txt
.ends dsm_counter_bit

.subckt nand_3 A B C OUT VDD GND
M3 out B VDD VDD P_50n l=50n w=1u
M7 out C VDD VDD P_50n l=50n w=1u
M8 out A VDD VDD P_50n l=50n w=1u
M10 N002 C GND 0 N_50n l=50n w=500n
M11 N001 B N002 0 N_50n l=50n w=500n
M12 out A N001 0 N_50n l=50n w=500n
.lib cmosedu_models.txt
.ends nand_3

.model NMOS NMOS
.model PMOS PMOS
.lib standard.mos
.lib cmosedu_models.txt
.ic v(vbit)=0.5
.tran 0 2.75u 100n uic
* Models the current of a floating gate memory cell. Adjust
* between 0 and 1 uA. Note how increasing the simulation time
* will increase the sense's SNR.
.measure mean(I(vdd))
* Note that you need to let the DSM sensing circuit run for a little while
* before you enable the counter. This drives the bitline to VREF. Here
* I cheat by using the .ic statement to minimize the simulation time.
* Store an initial value of 000000 to the counter
* Transfer the value into the counter prior to sensing
.backanno
.end